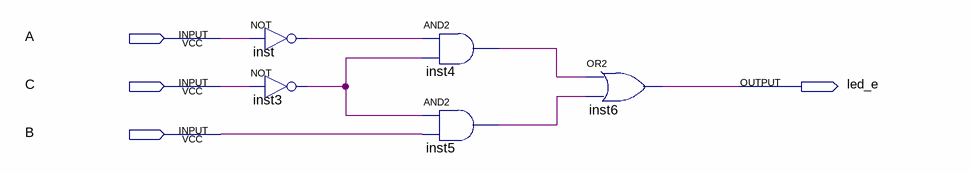
[diagram p0: schematic sheet]
// Quartus schematic led_e.bdf as structural Verilog: 5 symbols, 4 pins
module led_e (
  input  A,
  input  C,
  input  B,
  output led_e
);

  wire inst3_out, inst4_out, inst5_out, inst_out;

  not inst (inst_out, A);
  not inst3 (inst3_out, C);
  and inst4 (inst4_out, inst_out, inst3_out);
  and inst5 (inst5_out, inst3_out, B);
  or inst6 (led_e, inst4_out, inst5_out);
endmodule
